# Altium schematic sheet can_tcan1462v.SchDoc
size A; SheetNumber: 10
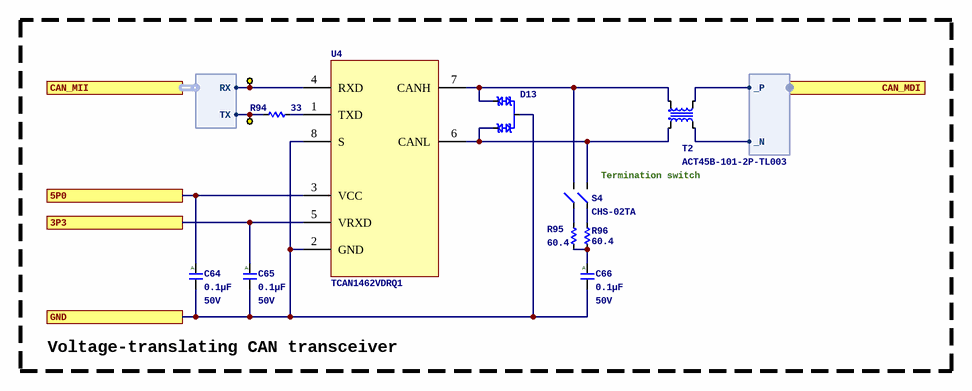
[diagram p0: can_tcan1462v.SchDoc]

## Parts
C64  Capacitance: 0.1µF  Voltage - Rated: 50V  [C0402_0.55MM]  (hidden comment: CGA2B3X7R1H104M050BB)
C65  Capacitance: 0.1µF  Voltage - Rated: 50V  [C0402_0.55MM]  (hidden comment: CGA2B3X7R1H104M050BB)
C66  Capacitance: 0.1µF  Voltage - Rated: 50V  [C0402_0.55MM]  (hidden comment: CGA2B3X7R1H104M050BB)
D13  PESD2CAN,215  [3SOT23]  (value not drawn)
R94  Resistance: 33  [R0402_0.40MM]  (hidden comment: ERJ-2RKF33R0X)
R95  Resistance: 60.4  [R0402_0.40MM]  (hidden comment: ERJ-2RKF60R4X)
R96  Resistance: 60.4  [R0402_0.40MM]  (hidden comment: ERJ-2RKF60R4X)
S4  CHS-02TA  [SWITCH_NIDEC_CHS-02TA]
T2  Manufacturer Part Number: ACT45B-101-2P-TL003  [CHOKE_ACT45B-101-2P-TL003]  (hidden comment: CHOKE_ACT45B-101-2P-TL003)
TP3  (no value)  [TP_GRABBY]  (no BOM)
TP4  (no value)  [TP_GRABBY]  (no BOM)
U4  TCAN1462VDRQ1  [8SOIC150]

## Ports
3P3, 5P0, CAN_MDI (harness DIFF), CAN_MII (harness CAN), GND

## Harnesses
CAN: TX, RX
DIFF: _P, _N

## Nets
3P3: C65.1 U4.5(VRXD) ; port 3P3
5P0: C64.1 U4.3(VCC) ; port 5P0
GND: C64.2 C65.2 C66.2 D13.3 U4.2(GND) U4.8(S) ; port GND
NetC66_1: C66.1 R95.2 R96.1
NetD13_1: D13.1 S4.2 T2.2 U4.7(CANH)
NetD13_2: D13.2 S4.4 T2.1 U4.6(CANL)
NetR94_1: R94.1 TP4.1 ; port CAN_MII.TX
NetR94_2: R94.2 U4.1(TXD)
NetR95_1: R95.1 S4.1
NetR96_2: R96.2 S4.3
NetT2_3: T2.3 ; port CAN_MDI._P
NetT2_4: T2.4 ; port CAN_MDI._N
NetTP3_1: TP3.1 U4.4(RXD) ; port CAN_MII.RX

## Notes on the sheet
- (near S4) Termination switch
- Voltage-translating CAN transceiver
- (in symbol CGA2B3X7R1H104M050BB) A

## Library data of the parts
C64-C66 = CGA2B3X7R1H104M050BB: CAP CER 0.1UF 50V X7R 0402; Manufacturer: TDK Corporation; Unit Price (USD): 0.17; Tolerance: ±20%; ComponentLink1URL: https://product.tdk.com/info/en/catalog/datasheets/mlcc_automotive_general_en.pdf?ref_disty=digikey; ComponentLink1Description: Series Datasheet; Series: CGA; Part Status: Active; Temperature Coefficient: X7R; Operating Temperature: -55°C ~ 125°C; Applications: AEC-Q200; Mounting Type: Surface Mount, MLCC; Package / Case: 0402 (1005 Metric); Size / Dimension: 0.039" L x 0.020" W (1.00mm x 0.50mm); Thickness (Max): 0.022" (0.55mm); Supplier 1: Digikey; Supplier Part Number 1: 445-12271-1-ND; Manufacturer Part Number: CGA2B3X7R1H104M050BB
D13 = TVS_PESD2CAN: DIODE ESD CAN SOT-23; Manufacturer: NXP Semiconductors; Supplier 1: Digikey; ComponentLink1URL: https://assets.nexperia.com/documents/data-sheet/PESD2CAN.pdf; ComponentLink1Description: Datasheet; Supplier Part Number 1: 1727-3891-1-ND; Manufacturer Part Number: PESD2CAN,215; Supplier 2: LCSC; Supplier Part Number 2: C75176
R94 = ERJ-2RKF33R0X: RES SMD 33 OHM 1% 1/10W 0402; Manufacturer: Panasonic Electronic Components; Unit Price (USD): 0.1; Power (Watts): 0.1W, 1/10W; Temperature Coefficient: ±100ppm/°C; ComponentLink1Description: Datasheet; ComponentLink1URL: https://industrial.panasonic.com/cdbs/www-data/pdf/RDA0000/AOA0000C304.pdf; Series: ERJ; Tolerance: ±1%; Composition: Thick Film; Features: Automotive AEC-Q200; Operating Temperature: -55°C ~ 155°C; Package / Case: 0402 (1005 Metric); Supplier Device Package: 0402; Size / Dimension: 0.039" L x 0.020" W (1.00mm x 0.50mm); Height - Seated (Max): 0.016" (0.40mm); Supplier 1: Digikey; Supplier Part Number 1: P33.0LCT-ND; Manufacturer Part Number: ERJ-2RKF33R0X
R95 R96 = ERJ-2RKF60R4X: RES SMD 60.4 OHM 1% 1/10W 0402; Manufacturer: Panasonic Electronic Components; Unit Price (USD): 0.1; Power (Watts): 0.1W, 1/10W; Temperature Coefficient: ±100ppm/°C; ComponentLink1Description: Datasheet; ComponentLink1URL: https://industrial.panasonic.com/cdbs/www-data/pdf/RDA0000/AOA0000C304.pdf; Series: ERJ; Tolerance: ±1%; Composition: Thick Film; Features: Automotive AEC-Q200; Operating Temperature: -55°C ~ 155°C; Package / Case: 0402 (1005 Metric); Supplier Device Package: 0402; Size / Dimension: 0.039" L x 0.020" W (1.00mm x 0.50mm); Height - Seated (Max): 0.016" (0.40mm); Supplier 1: Digikey; Supplier Part Number 1: P60.4LCT-ND; Manufacturer Part Number: ERJ-2RKF60R4X
S4 = SWITCH_CHS-02TA: DIP Switch, Slide, SPST, Flush, Recessed, 6VDC, 100mA, CHS Series | Nidec Components CHS-02TA; Manufacturer: Nidec Copal; Supplier 1: Digikey; Supplier Part Number 1: 563-1005-1-ND; Manufacturer Part Number: CHS-02TA; Supplier 2: LCSC; Supplier Part Number 2: C2921606; ComponentLink1Description: Datasheet; ComponentLink1URL: https://www.nidec-components.com/e/catalog/switch/chs.pdf
T2 = CHOKE_ACT45B-101-2P-TL003: CHOKE COMMON MODE 5000 OHM SMD; Manufacturer: TDK Corporation; Supplier 1: Digikey; Size / Dimension: 0.177" L x 0.126" W (4.50mm x 3.20mm); ComponentLink1URL: http://www.tdk.co.jp/tefe02/e9711_act.pdf; ComponentLink1Description: Datasheet; Supplier Part Number 1: 445-3959-1-ND; Supplier 2: LCSC; Supplier Part Number 2: C88056
TP3 TP4 = TEST_GRABBER: EMBEDDED TEST POINT FOR SALEAE TEST CLIPS
U4 = CAN_TCAN1462VDRQ1: Automotive signal improvement CAN FD transceiver with VIO and standby 8-SOIC -40 to 125; Manufacturer: Texas Instruments; Supplier 1: Digikey; Supplier Part Number 1: 296-TCAN1462VDRQ1CT-ND; Manufacturer Part Number: TCAN1462VDRQ1; ComponentLink1Description: Datasheet; ComponentLink1URL: https://www.ti.com/lit/ds/symlink/tcan1462-q1.pdf; Supplier 2: LCSC; Supplier Part Number 2: C7399456